# Altium schematic sheet HC-05.SchDoc
size A4
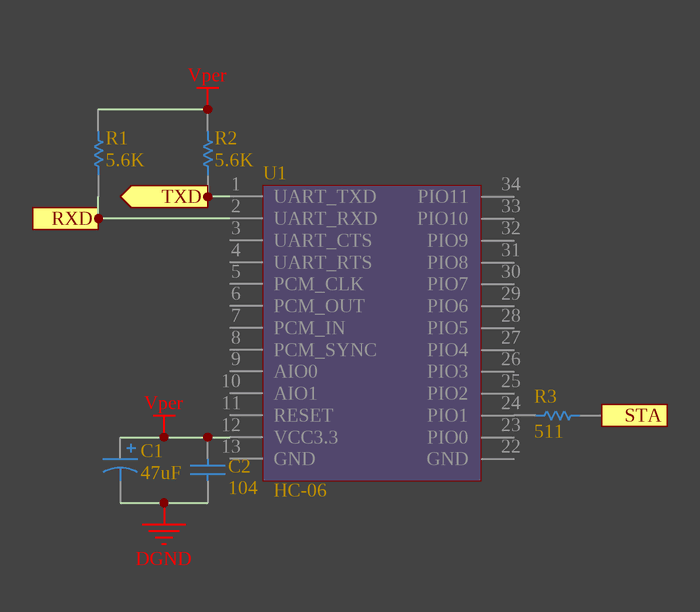
[diagram p0: HC-05.SchDoc]

## Parts
C1  47uF  [贴片电解 6.3*5.4]
C2  104  [C0402]
R1  5.6K  [R0402]
R2  5.6K  [R0402]
R3  511  [R0402]
U1  HC-06  [HC-05]

## Ports
RXD (in), STA (out), TXD (out)

## Nets
DGND: C1.2 C2.1
Vper: C1.1 C2.2 R1.2 R2.2 U1.12(VCC3.3)
RXD: R1.1 U1.2(UART_RXD) ; port RXD
STA: R3.1 ; port STA
TXD: R2.1 U1.1(UART_TXD) ; port TXD
NetR3_2: R3.2 U1.24(PIO1)

Not connected (* = marked no-connect by the designer): U1 3(UART_CTS) 4(UART_RTS) 5(PCM_CLK) 6(PCM_OUT) 7(PCM_IN) 8(PCM_SYNC) 9(AIO0) 10(AIO1) 11(RESET) 13(GND) 22(GND) 23(PIO0) 25(PIO2) 26(PIO3) 27(PIO4) 28(PIO5) 29(PIO6) 30(PIO7) 31(PIO8) 32(PIO9) 33(PIO10) 34(PIO11)

## Library data of the parts
C1 = 电解电容: Polarized Capacitor (Axial); Value: 100pF; Published: 8-Jun-2000; LatestRevisionDate: 17-Jul-2002; LatestRevisionNote: Re-released for DXP Platform.; PackageReference: POLAR0.8; Publisher: Altium Limited; PackageDescription: Polarized Capacitor; 2 Leads
C2 = 电容: Capacitor; Value: 22pF; Published: 8-Jun-2000; LatestRevisionDate: 17-Jul-2002; LatestRevisionNote: Re-released for DXP Platform.; PackageReference: RAD-0.3; Publisher: Altium Limited; PackageDescription: Radial Cap, Thru-Hole; 2 Leads; 0.3 in Pin Spacing
R1-R3 = 电阻: Resistor; Value: 150R; Published: 8-Jun-2000; LatestRevisionDate: 17-Jul-2002; LatestRevisionNote: Re-released for DXP Platform.; PackageReference: AXIAL-0.3; Publisher: Altium Limited; PackageDescription: Axial Device, Thru-Hole; 2 Leads; 0.3 in Pin Spacing
U1 = HC-05: 蓝牙串口模块